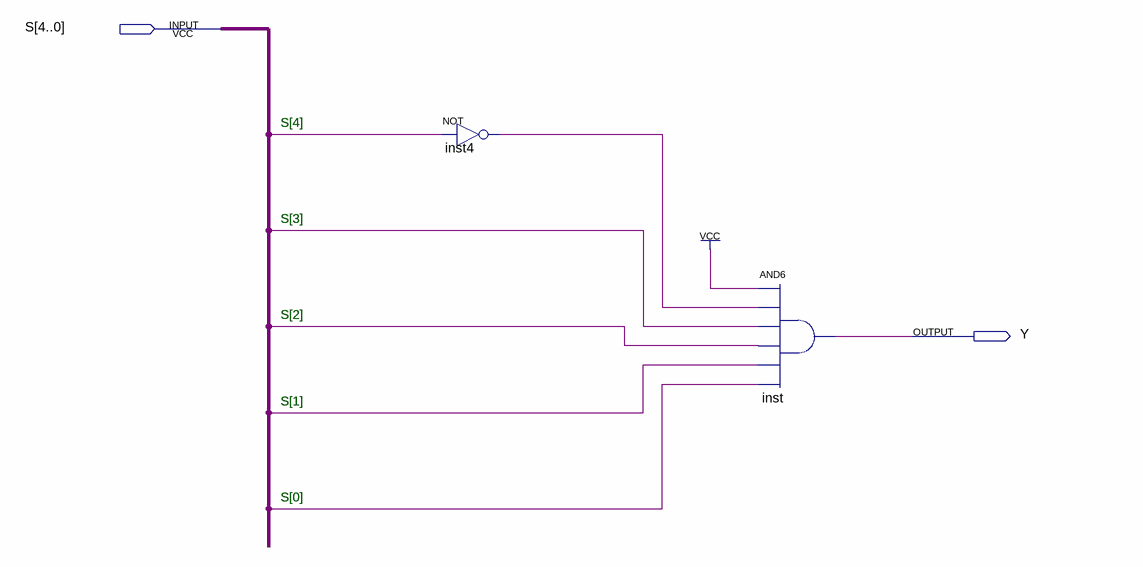
[diagram p0: schematic sheet]
// Quartus schematic S15.bdf as structural Verilog: 2 symbols, 2 pins
module S15 (
  input  [4:0] S,
  output Y
);

  wire inst4_out;

  not inst4 (inst4_out, S[4]);
  and inst (Y, 1'b1, inst4_out, S[3], S[2], S[1], S[0]);

  // Notes on the sheet:
  //   S[4]
  //   S[3]
  //   S[2]
  //   S[1]
  //   S[0]
endmodule
